# Altium schematic sheet MachNhan.SchDoc
size 508 x 381 mm
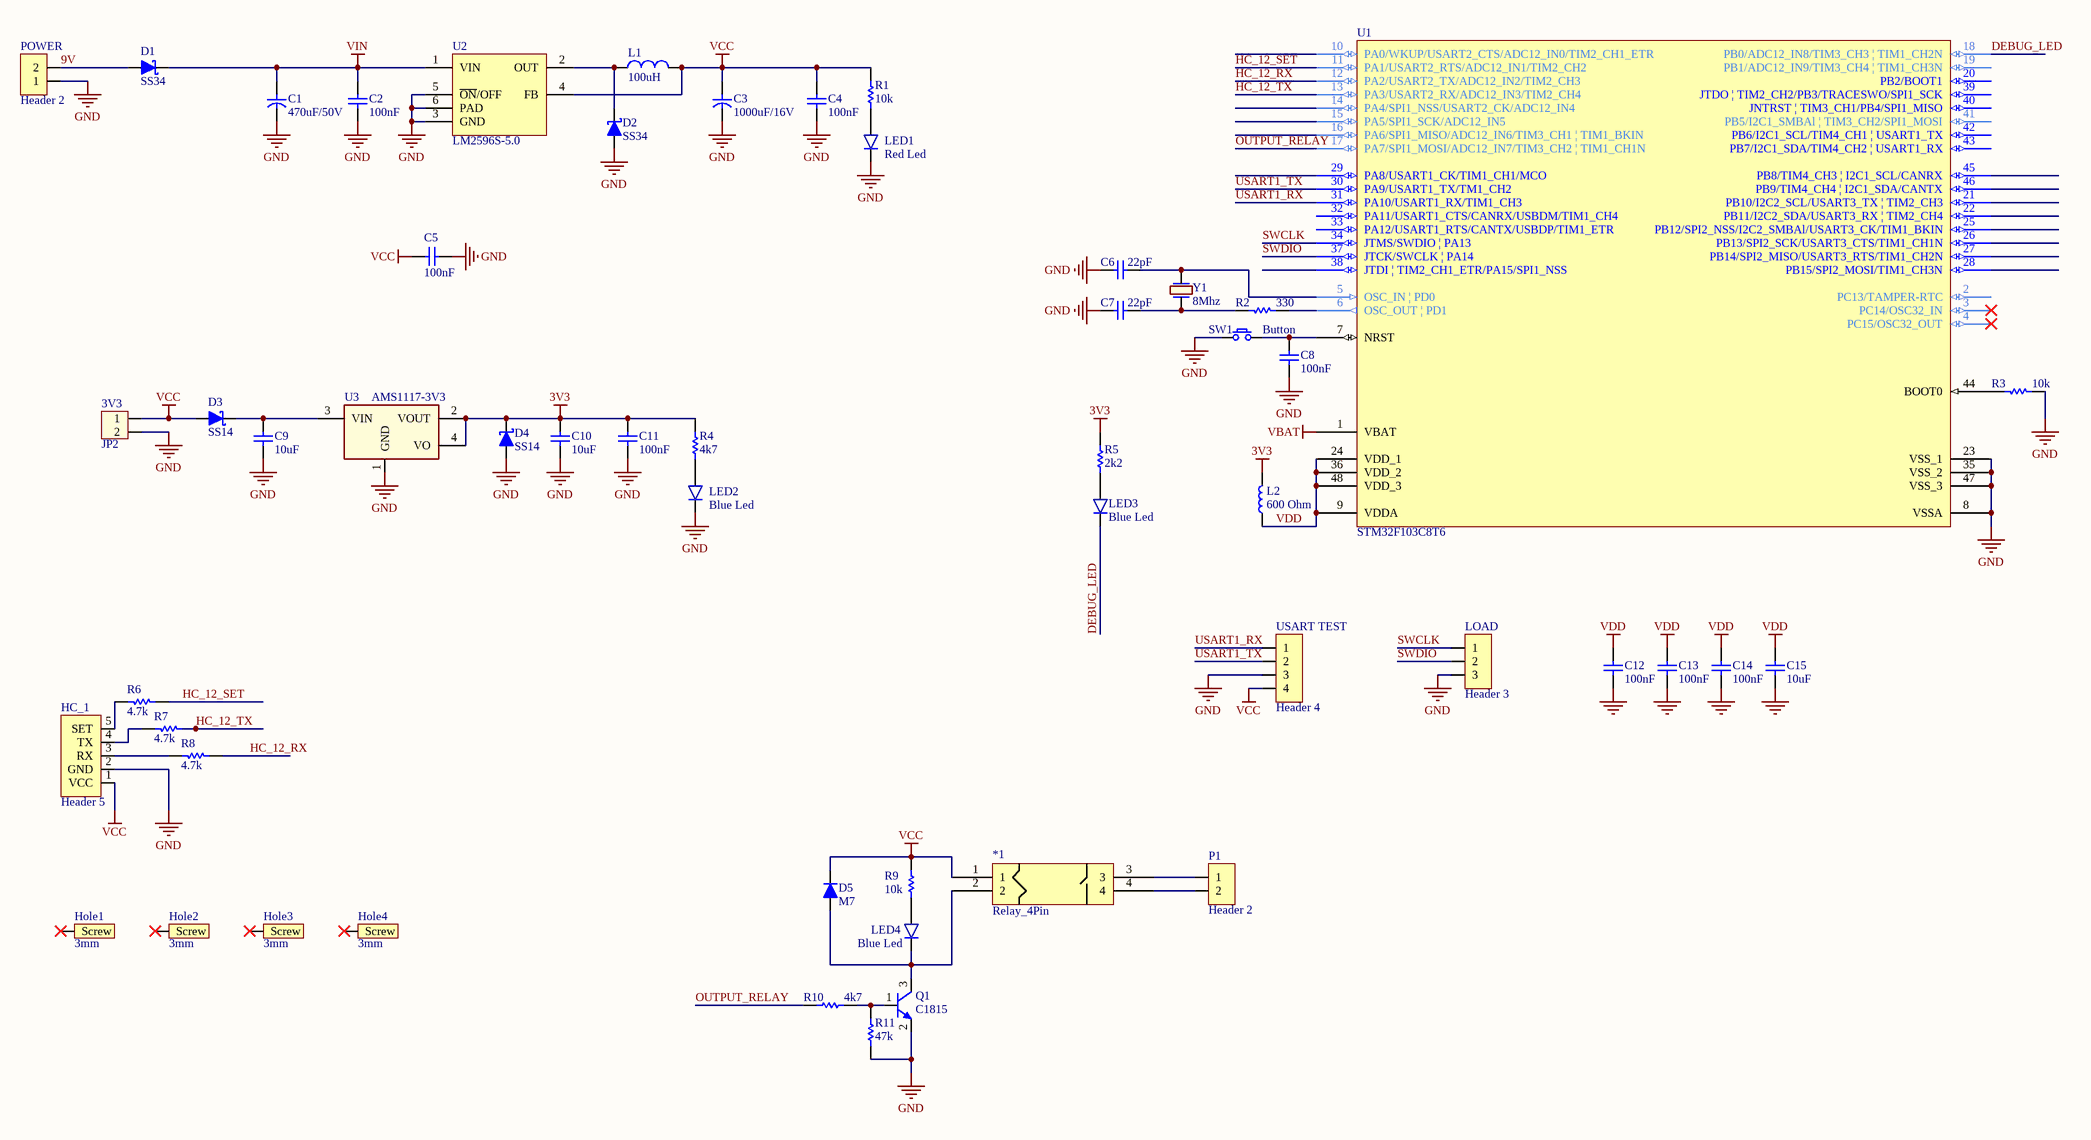
[diagram p0: MachNhan.SchDoc]

## Parts
3V3  JP2  [CON Header 2]
*1  Relay_4Pin  [Relay4 - duplicate]
C1  470uF/50V  [CR/D.10.0x16.0/P.5.0]
C2  100nF  [C 0805 (2012)]
C3  1000uF/16V  [CR/D.10.0x12.5/P.5.0]
C4  100nF  [C 0805 (2012)]
C5  100nF  [C 0805 (2012)]
C6  22pF  [C 0805 (2012)]
C7  22pF  [C 0805 (2012)]
C8  100nF  [C 0805 (2012)]
C9  10uF  [C 0805 (2012)]
C10  10uF  [C 0805 (2012)]
C11  100nF  [C 0805 (2012)]
C12  100nF  [C 0805 (2012)]
C13  100nF  [C 0805 (2012)]
C14  100nF  [C 0805 (2012)]
C15  10uF  [C 0805 (2012)]
D1  SS34  [DO-214AC (SMA)]
D2  SS34  [DO-214AC (SMA)]
D3  SS14  [DO-214AC (SMA)]
D4  SS14  [DO-214AC (SMA)]
D5  M7  [DO-214AC (SMA)]
HC_1  Header 5  [HC_12]
Hole1  3mm  [SCREW/3M/7M]
Hole2  3mm  [SCREW/3M/7M]
Hole3  3mm  [SCREW/3M/7M]
Hole4  3mm  [SCREW/3M/7M]
L1  100uH  [Inductor SMD 12x12x8]
L2  600 Ohm  [Inductor SMD 0805 (2012)]
LED1  Red Led  [Led SMD 0805]
LED2  Blue Led  [Led SMD 0805]
LED3  Blue Led  [Led SMD 0805]
LED4  Blue Led  [Led SMD 0805]
LOAD  Header 3  [Header 3]
P1  Header 2  [Header 2]
POWER  Header 2  [CON Header 2]
Q1  C1815  [SOT-23]
R1  10k  [R 0805 (2012)]
R2  330  [R 0805 (2012)]
R3  10k  [R 0805 (2012)]
R4  4k7  [R 0805 (2012)]
R5  2k2  [R 0805 (2012)]
R6  4.7k  [R 0805 (2012)]
R7  4.7k  [R 0805 (2012)]
R8  4.7k  [R 0805 (2012)]
R9  10k  [R 0805 (2012)]
R10  4k7  [R 0805 (2012)]
R11  47k  [R 0805 (2012)]
SW1  Button  [SW/2/SMD]
U1  STM32F103C8T6  [LQFP48_N]
U2  LM2596S-5.0  [TO-263-5]
U3  AMS1117-3V3  [SOT-223]
USART_TEST  Header 4  [CON Header 4]
Y1  8Mhz  [Crystal HC49US SMD]

## Nets
3V3: C10.1 C11.1 D4.2(K) L2.2 R4.2 R5.2 U3.2(VOUT) U3.4(VO)
GND: 3V3.2 C1.2 C2.2 C3.2 C4.2 C5.1 C6.2 C7.2 C8.2 C9.2 C10.2 C11.2 C12.2 C13.2 C14.2 C15.2 D2.1(A) D4.1(A) HC_1.2(GND) LED1.2(K) LED2.2(K) LOAD.3 POWER.1 Q1.2(E) R3.1 R11.1 SW1.1 U1.8(VSSA) U1.23(VSS_1) U1.35(VSS_2) U1.47(VSS_3) U2.3(GND) U2.5(~{ON}/OFF) U2.6(GND) U3.1(GND) USART_TEST.3
VBAT: U1.1(VBAT)
VCC: 3V3.1 *1.1 C3.1 C4.1 C5.2 D3.1(A) D5.2(K) HC_1.1(VCC) L1.2 R1.2 R9.2 U2.4(FB) USART_TEST.4
VDD: C12.1 C13.1 C14.1 C15.1 L2.1 U1.9(VDDA) U1.24(VDD_1) U1.36(VDD_2) U1.48(VDD_3)
VIN: C1.1 C2.1 D1.2(K) U2.1(VIN)
9V: D1.1(A) POWER.2
DEBUG_LED: LED3.2(K) U1.18(PB0/ADC12_IN8/TIM3_CH3_|_TIM1_CH2N)
HC_12_RX: R8.2 U1.12(PA2/USART2_TX/ADC12_IN2/TIM2_CH3)
HC_12_SET: R6.2 U1.11(PA1/USART2_RTS/ADC12_IN1/TIM2_CH2)
HC_12_TX: R7.2 U1.13(PA3/USART2_RX/ADC12_IN3/TIM2_CH4)
OUTPUT_RELAY: R10.1 U1.17(PA7/SPI1_MOSI/ADC12_IN7/TIM3_CH2_|_TIM1_CH1N)
SWCLK: LOAD.1 U1.34(JTMS/SWDIO_|_PA13)
SWDIO: LOAD.2 U1.37(JTCK/SWCLK_|_PA14)
USART1_RX: U1.31(PA10/USART1_RX/TIM1_CH3) USART_TEST.1
USART1_TX: U1.30(PA9/USART1_TX/TM1_CH2) USART_TEST.2
Net*1_2: *1.2 D5.1(A) LED4.2(K) Q1.3(C)
Net*1_3: *1.3 P1.1
Net*1_4: *1.4 P1.2
NetC6_1: C6.1 U1.5(OSC_IN_|_PD0) Y1.2
NetC7_1: C7.1 R2.2 Y1.1
NetC8_1: C8.1 SW1.2 U1.7(NRST)
NetC9_1: C9.1 D3.2(K) U3.3(VIN)
NetD2_2: D2.2(K) L1.1 U2.2(OUT)
NetHC_1_3: HC_1.3(RX) R8.1
NetHC_1_4: HC_1.4(TX) R7.1
NetHC_1_5: HC_1.5(SET) R6.1
NetLED1_1: LED1.1(A) R1.1
NetLED2_1: LED2.1(A) R4.1
NetLED3_1: LED3.1(A) R5.1
NetLED4_1: LED4.1(A) R9.1
NetQ1_1: Q1.1(B) R10.2 R11.2
NetR2_1: R2.1 U1.6(OSC_OUT_|_PD1)
NetR3_2: R3.2 U1.44(BOOT0)

Not connected (* = marked no-connect by the designer): Hole1 1(Screw)*; Hole2 1(Screw)*; Hole3 1(Screw)*; Hole4 1(Screw)*; U1 2(PC13/TAMPER-RTC) 3(PC14/OSC32_IN)* 4(PC15/OSC32_OUT)* 10(PA0/WKUP/USART2_CTS/ADC12_IN0/TIM2_CH1_ETR) 14(PA4/SPI1_NSS/USART2_CK/ADC12_IN4) 15(PA5/SPI1_SCK/ADC12_IN5) 16(PA6/SPI1_MISO/ADC12_IN6/TIM3_CH1_|_TIM1_BKIN) 19(PB1/ADC12_IN9/TIM3_CH4_|_TIM1_CH3N) 20(PB2/BOOT1) 21(PB10/I2C2_SCL/USART3_TX_|_TIM2_CH3) 22(PB11/I2C2_SDA/USART3_RX_|_TIM2_CH4) 25(PB12/SPI2_NSS/I2C2_SMBAl/USART3_CK/TIM1_BKIN) 26(PB13/SPI2_SCK/USART3_CTS/TIM1_CH1N) 27(PB14/SPI2_MISO/USART3_RTS/TIM1_CH2N) 28(PB15/SPI2_MOSI/TIM1_CH3N) 29(PA8/USART1_CK/TIM1_CH1/MCO) 32(PA11/USART1_CTS/CANRX/USBDM/TIM1_CH4) 33(PA12/USART1_RTS/CANTX/USBDP/TIM1_ETR) 38(JTDI_|_TIM2_CH1_ETR/PA15/SPI1_NSS) 39(JTDO_|_TIM2_CH2/PB3/TRACESWO/SPI1_SCK) 40(JNTRST_|_TIM3_CH1/PB4/SPI1_MISO) 41(PB5/I2C1_SMBAl_|_TIM3_CH2/SPI1_MOSI) 42(PB6/I2C1_SCL/TIM4_CH1_|_USART1_TX) 43(PB7/I2C1_SDA/TIM4_CH2_|_USART1_RX) 45(PB8/TIM4_CH3_|_I2C1_SCL/CANRX) 46(PB9/TIM4_CH4_|_I2C1_SDA/CANTX)

## Library data of the parts
3V3 = Con2: Connector 2; Value: Connector 2
C1 C3 = Capacitor: Capacitor pol
C2 C4-C15 = Capacitor NP: Capacitor non-pol
D1-D4 = Diode Schottky: Schottky Diode; Published: 8-Jun-2000; LatestRevisionDate: 17-Jul-2002; LatestRevisionNote: Re-released for DXP Platform.; PackageReference: SMB; Publisher: Altium Limited; Code_JEDEC: DO-214-AA
D5 = Diode: Default Diode; Published: 8-Jun-2000; LatestRevisionDate: 17-Jul-2002; LatestRevisionNote: Re-released for DXP Platform.; PackageVersion: Sep-1996; PackageReference: SMC; Publisher: Altium Limited; Code_JEDEC: DO-214-AB
HC_1 = HC_12: Header, 5-Pin; LatestRevisionDate: 17-Jul-2002; LatestRevisionNote: Re-released for DXP Platform.; Publisher: Altium Limited
Hole1-Hole4 = Screw
L1 = L1: Inductor; Value: 150 mH
L2 = Inductor
LED1-LED4 = Led: Typical LED
LOAD = Header 3: Header, 3-Pin
P1 POWER = Header 2: Header, 2-Pin; LatestRevisionDate: 17-Jul-2002; LatestRevisionNote: Re-released for DXP Platform.; Publisher: Altium Limited
Q1 = Transistor NPN: NPN Bipolar Transistor
R1-R11 = Resistor: Published: 8-Jun-2000; LatestRevisionDate: 17-Jul-2002; LatestRevisionNote: Re-released for DXP Platform.; PackageReference: AXIAL-0.3; Publisher: Altium Limited
SW1 = SW SPST: Tact switch 2 pin
U1 = STM32F103C8T6: STM32 ARM-based 32-bit MCU with 64 Kbytes Flash, 48-pin LQFP, Industrial Temperature; Published: 30-May-2008; DatasheetVersion: rev6, Mar-2008; PackageVersion: Mar-2008; PackageReference: LQFP48; Publisher: Altium Limited; PackageDescription: 48-Pin Low-Profile Quad Flat Pack, 7 x 7 mm Body, 0.5 mm Pitch (LQFP48); ComponentLink1Description: Manufacturer Link; ComponentLink1URL: www.st.com/stm32; ComponentLink2Description: Datasheet; ComponentLink2URL: http://www.st.com/stonline/products/literature/ds/13587.pdf
U2 = LM2576/96: SIMPLE SWITCHER® 3A Step-Down Voltage Regulator
U3 = AMS1117: 1A LDO Voltage Regulator, ADJ or fixed 1.5/1.8/2.5/2.85/3.3/5V
USART_TEST = Header 4: Header, 4-Pin
Y1 = Crystal